# EAGLE design LampenSteuerung Driver (EAGLE 7.5.0)
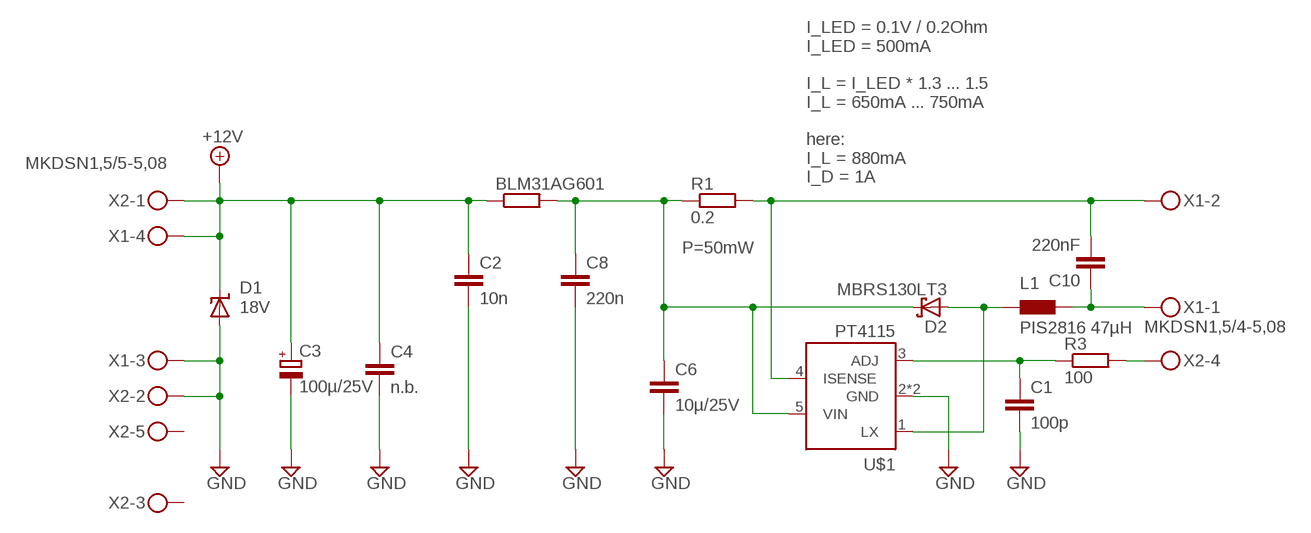
[diagram p0: schematic, sheet 1]

## Parts
BLM31AG601  R-EU_R1206  [R1206]
C1  100p  C-EUC0603  [C0603]
C2  10n  C-EUC0603  [C0603]
C3  100µ/25V  CPOL-EUE2.5-6  [E2,5-6]
C4  n.b.  C-EUC1210  [C1210]
C6  10µ/25V  C-EUC1206  [C1206]
C8  220n  C-EUC0603  [C0603]
C10  220nF  C-EUC0603  [C0603]
D1  18V  SUPPRESSOR-SMBJ  [SMBJ]
D2  MBRS130LT3  [SMB]
L1  PIS2816 47µH  PIS2816  [PIS2816]
R1  0.2  R-EU_R1206  [R1206]
R3  100  R-EU_R1206  [R1206]
U$1  PT4115  [SOT89-5]
X1  MKDSN1,5/4-5,08  [MKDSN1,5/4-5,08]
X2  MKDSN1,5/5-5,08  [MKDSN1,5/5-5,08]

## Nets
+12V: BLM31AG601.1 C2.1 C3.+ C4.1 D1.C X1.4 X2.1
GND: C1.2 C2.2 C3.- C4.2 C6.2 C8.2 D1.A U$1.2(GND) U$1.2.1(GND) X1.3 X2.2
N$1: C1.1 R3.1 U$1.3(ADJ)
N$2: C10.2 R1.2 U$1.4(ISENSE) X1.2
N$3: C10.1 L1.P$2 X1.1
N$4: D2.A L1.P$1 U$1.1(LX)
N$5: R3.2 X2.4
N$7: BLM31AG601.2 C6.1 C8.1 D2.C R1.1 U$1.5(VIN)
Unconnected: X2.3 X2.5

## Notes on the sheet
- I_LED = 0.1V / 0.2Ohm
  I_LED = 500mA
  
  I_L = I_LED * 1.3 ... 1.5
  I_L = 650mA ... 750mA
  
  here:
  I_L = 880mA
  I_D = 1A
- P=50mW

## Library data of the parts
BLM31AG601 R1 R3 = rcl:R-EU_: RESISTOR, European symbol
C1 C2 C4 C6 C8 C10 = rcl:C-EU: CAPACITOR, European symbol
C3 = rcl:CPOL-EU: POLARIZED CAPACITOR, European symbol
D1 = diode:SUPPRESSOR-: Suppressor diode
D2 = diode:MBRS130LT3: Schottky Power Rectifier Source: http://www.onsemi.com/pub/Collateral/MBRS130LT3-D.PDF
L1 = inductor-fastron:PIS2816: Fastron SMD Power Inductors Source: http://www.fastrongroup.com/series/50/findProducts
U$1 = Martin:PT4115: LED driver with internal switch
X1 = con-phoenix-508:MKDSN1,5/4-5,08: MKDSN 1,5/ 4-5,08 Printklemme Nennstrom: 13,5 A Nennspannung: 250 V Rastermaß: 5,08 mm Polzahl: 4 Anschlussart: Schraubanschluss Montage: Löten Anschlussrichtung Leiter/Platine: 0 ° Artikelnummer: 1729144 Source: http://eshop.phoenixcontact.com .. 1729144.pdf
X2 = con-phoenix-508:MKDSN1,5/5-5,08: MKDSN 1,5/ 5-5,08 Printklemme Nennstrom: 13,5 A Nennspannung: 250 V Rastermaß: 5,08 mm Polzahl: 5 Anschlussart: Schraubanschluss Montage: Löten Anschlussrichtung Leiter/Platine: 0 ° Artikelnummer: 1729157 Source: http://eshop.phoenixcontact.com .. 1729157.pdf

## Board
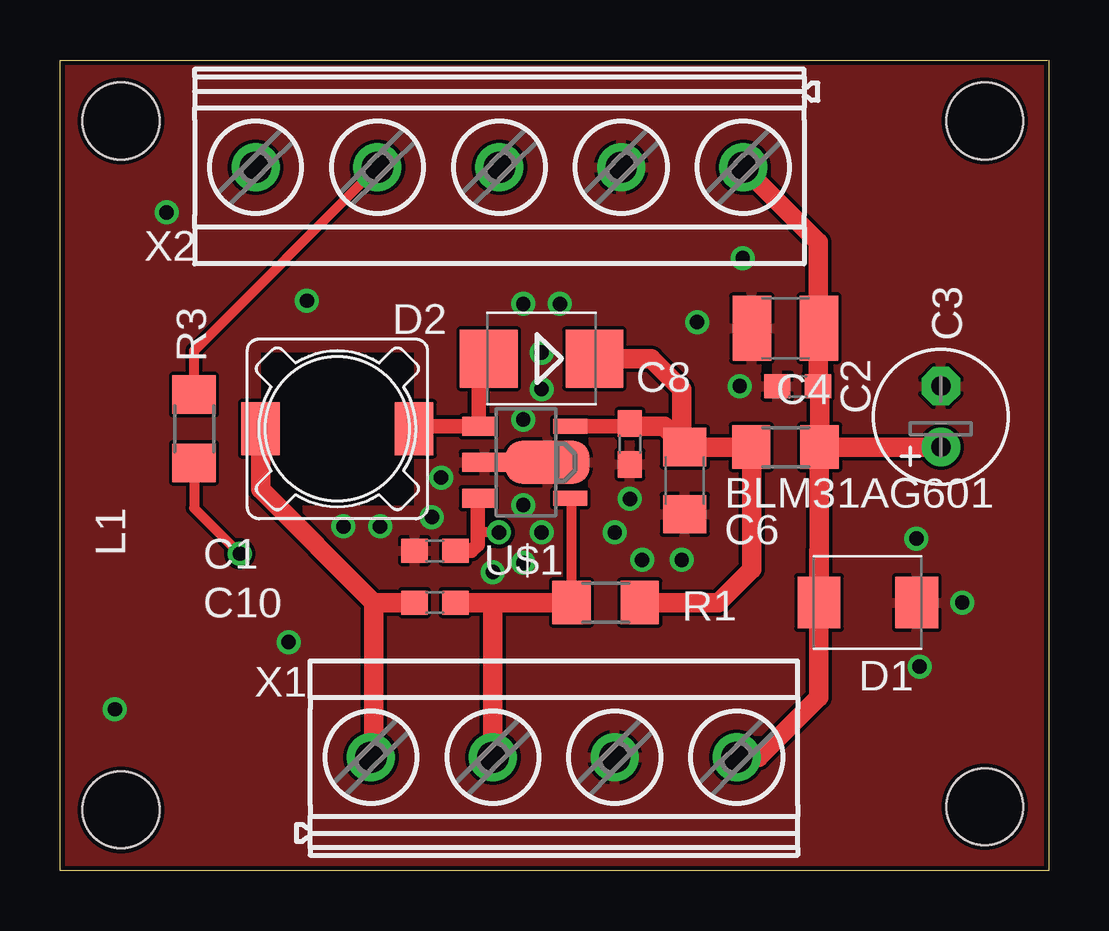
[diagram p1: board, top side]
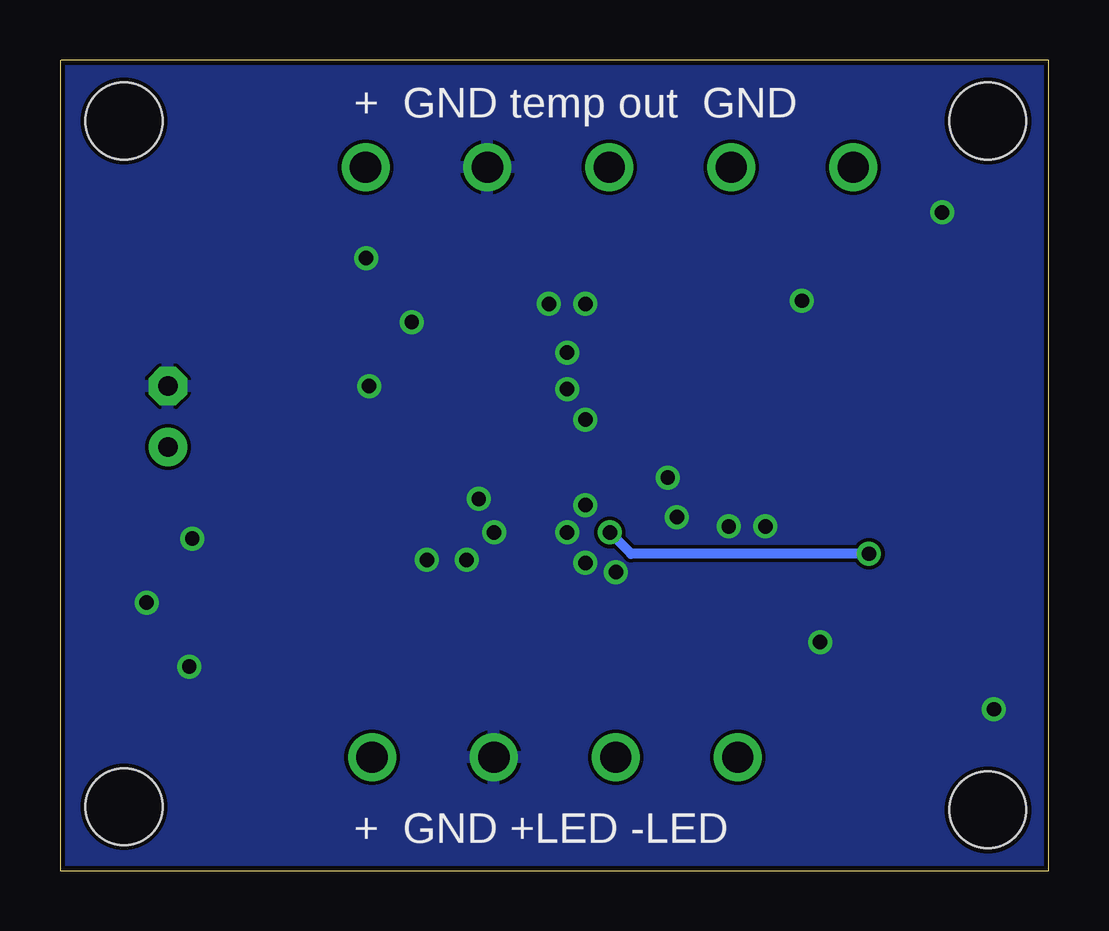
[diagram p2: board, bottom side, seen from below]

Size 41.2 x 33.78 mm. Coordinates in mm from the lower left corner, seen from the top.
Outline: 41.2,33.78 41.2,0 0,0 0,33.78 41.15,33.78
Copper layers (1*16): Top 0.035mm / dielectric 1.5mm / Bottom 0.035mm
Design rules "platinensammler_02": minimum track width 0.15mm, minimum drill 0.3mm, track to track 0.15mm, track to pad 0.15mm, pad to pad 0.15mm, via to via 0.15mm, smd to smd 0mil, copper to edge 0.2mm, drill to drill 0.2mm, minimum pad ring 0.2mm, minimum via ring 0.2mm, stop-mask expansion 4mil, vias tented up to drill 0.8mm, thermal gap 0.15mm
Holes 3.2 mm at 38.53,2.67 2.54,2.54 2.54,31.24 38.53,31.24
tRestrict: area 8.4,15.2 to 14.7,21.6

### Footprints (pad centres in the part's own frame; a part is rotated, then mirrored left to right if it is on the bottom)
R1206 = smd 1.6 x 1.803: 1 -1.422,0; 2 1.422,0
C0603 = smd 1.1 x 1: 1 -0.85,0; 2 0.85,0
E2,5-6 = drill 0.813 pad 1.6: + -1.27,0 | drill 0.813 pad 1.6 octagon: - 1.27,0
C1210 = smd 1.6 x 2.7: 1 -1.4,0; 2 1.4,0
C1206 = smd 1.6 x 1.8: 1 -1.4,0; 2 1.4,0
SMBJ = smd 1.78 x 2.16: A 2.04,0; C -2.03,0
SMB = smd 2.4 x 2.4: A 2.2,0; C -2.2,0
PIS2816 = smd 2.2 x 1.6: P$1 0,3.2; P$2 0,-3.2
SOT89-5 = smd 0.8 x 1.4: 1 -1.499,-1.981; 3 1.499,-1.981 | smd 0.8 x 1.9: 2 0,-1.727 | smd 1.778 x 3.5: 2.1 0,0.889 | smd 0.635 x 1.4: 4 1.499,1.829; 5 -1.499,1.829
MKDSN1,5/4-5,08 = drill 1.3 pad 2: 1 -7.641,0.025; 2 -2.561,0.025; 3 2.519,0.025; 4 7.599,0.025
MKDSN1,5/5-5,08 = drill 1.3 pad 2: 1 -10.181,0.025; 2 -5.101,0.025; 3 -0.021,0.025; 4 5.059,0.025; 5 10.139,0.025

### Placement (x,y rotation side)
BLM31AG601  30.23,17.65 180 top
C1  15.62,13.34 180 top
C2  30.73,20.19 180 top
C3  36.7,18.92 90 top
C4  30.23,22.61 180 top
C6  26.04,16.26 270 top
C8  23.75,17.78 270 top
C10  15.62,11.18 0 top
D1  33.66,11.18 0 top
D2  20.07,21.34 180 top
L1  11.56,18.41 270 top
R1  22.73,11.18 180 top
R3  5.59,18.41 90 top
U$1  19.43,17.02 270 top
X1  20.6,4.7 0 top
X2  18.29,29.34 180 top

### Tracks (layer width: path | path; a pad name or v marks a point on that pad's centre or on a via)
+12V
  Top 0.406: C4.1 31.58,22.61 C2.1
  Top 0.813: X1.4 29.11,4.72 31.62,7.24 31.62,13.33 D1.C 31.62,17.63 BLM31AG601.1 | BLM31AG601.1 31.65,20.13 C2.1 31.58,26.2 X2.1 | C3.+ BLM31AG601.1
GND  (via drill 0.6)
  Top 0.61: U$1.2.1 U$1.2
  other vias: 23.75,15.49 9.53,9.53 10.29,23.75 23.11,14.1 2.29,6.73 35.69,13.84 4.45,27.43 13.34,14.35 11.81,14.35 20.07,14.1 19.3,12.83 18.03,12.45 19.3,15.24 19.3,18.8 15.88,16.38 15.49,14.73 20.07,20.07 20.07,21.59 19.3,23.62 20.83,23.62 35.81,8.51 37.59,11.18 26.54,22.86 28.32,20.19 25.91,12.95 24.26,12.95 28.45,25.53
  pour Bottom: 41.2,33.78 0,33.78 0,0 41.2,0
  pour Top: 41.2,33.78 0,33.78 0,-0.13 41.2,0
N$1  (via drill 0.6)
  Top 0.406: R3.1 5.59,15.11 v7.49,13.21 | v18.29,14.1 17.53,14.1 17.4,13.97
  Top 0.61: C1.1 17.14,13.34 17.4,13.59 17.4,13.97 17.4,15.47 U$1.3
  Bottom 0.406: v7.49,13.21 17.4,13.21 v18.29,14.1
N$2
  Top 0.406: X1.2 | U$1.4 21.31,15.52 R1.2
  Top 0.813: 18.03,11.18 X1.2 | C10.2 18.03,11.18 | R1.2 18.03,11.18
N$3
  Top 0.406: 13.08,11.18 13.08,11.05 13.21,11.18 | 13.08,4.85 X1.1
  Top 0.813: L1.P$2 8.36,15.9 13.08,11.18 | 13.08,11.05 13.08,4.85 | C10.1 13.21,11.18
N$4
  Top 0.406: 14.86,18.52 L1.P$1 | 17.45,20.92 D2.A
  Top 0.61: 14.86,18.52 U$1.1 17.45,20.92
N$5
  Top 0.406: R3.2 5.59,21.67 X2.4
N$7
  Top 0.61: U$1.5 23.75,18.52 C8.1
  Top 0.813: C6.1 BLM31AG601.2 28.83,17.63 28.83,12.57 27.43,11.18 R1.1 | D2.C 24.64,21.34 25.91,20.07 25.91,17.78 C6.1 | 23.75,18.52 25.17,18.52 C6.1

### Text on the board
bNames: + GND temp out GND | + GND +LED -LED